# Altium project m12can.PrjPCB
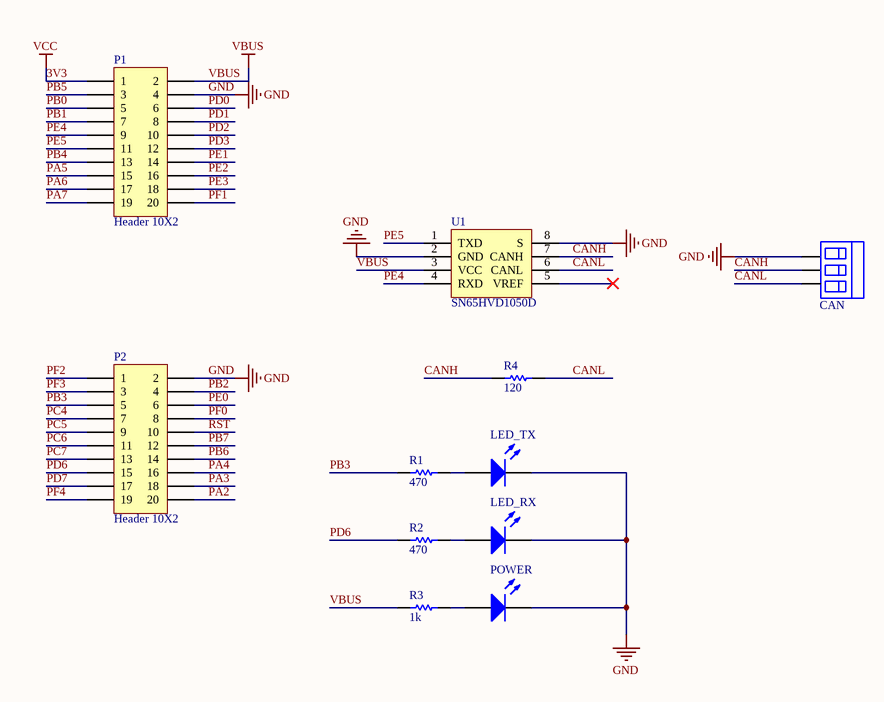
[diagram p0: m12can.SchDoc]
1 sheet, 11 parts. Net scope: global (net labels, ports and power ports of the same name join across sheets).
Board file: m12can.PcbDoc

## Sheet m12can.SchDoc
size A4

### Parts
CAN  CAN  [MKDSN_3RMI]  (value not drawn)
LED_RX  LED2  [LED_0603_RED]  (value not drawn)
LED_TX  LED2  [LED_0603_RED]  (value not drawn)
P1  Header 10X2  [HDR2X10]
P2  Header 10X2  [HDR2X10]
POWER  LED2  [LED_0603_RED]  (value not drawn)
R1  value 470  [RES_0603]  (hidden comment: Res1)
R2  value 470  [RES_0603]  (hidden comment: Res1)
R3  value 1k  [RES_0603]  (hidden comment: Res1)
R4  value 120  [RES_0603]  (hidden comment: Res1)
U1  SN65HVD1050D  [SOIC-8]

### Nets
3V3: P1.1  [also labelled VCC]
GND: CAN.1 LED_RX.2(K) LED_TX.2(K) P1.4 P2.2 POWER.2(K) U1.2(GND) U1.8(S)
VBUS: P1.2 R3.1 U1.3(VCC)
CANH: CAN.2 R4.1 U1.7(CANH)
CANL: CAN.3 R4.2 U1.6(CANL)
PA2: P2.20
PA3: P2.18
PA4: P2.16
PA5: P1.15
PA6: P1.17
PA7: P1.19
PB0: P1.5
PB1: P1.7
PB2: P2.4
PB3: P2.5 R1.1
PB4: P1.13
PB5: P1.3
PB6: P2.14
PB7: P2.12
PC4: P2.7
PC5: P2.9
PC6: P2.11
PC7: P2.13
PD0: P1.6
PD1: P1.8
PD2: P1.10
PD3: P1.12
PD6: P2.15 R2.1
PD7: P2.17
PE0: P2.6
PE1: P1.14
PE2: P1.16
PE3: P1.18
PE4: P1.9 U1.4(RXD)
PE5: P1.11 U1.1(TXD)
PF0: P2.8
PF1: P1.20
PF2: P2.1
PF3: P2.3
PF4: P2.19
RST: P2.10
NetLED_RX_1: LED_RX.1(A) R2.2
NetLED_TX_1: LED_TX.1(A) R1.2
NetPOWER_1: POWER.1(A) R3.2

Not connected (* = marked no-connect by the designer): U1 5(VREF)*

### Library data of the parts
CAN = HEAD3
LED_RX LED_TX POWER = LED2: Typical RED, GREEN, YELLOW, AMBER GaAs LED; Published: 8-Jun-2000; LatestRevisionDate: 17-Jul-2002; LatestRevisionNote: Re-released for DXP Platform.; PackageVersion: Feb-2002; PackageReference: 3.2X1.6X1.1; Publisher: Altium Limited
P1 P2 = Header 10X2: Header, 10-Pin, Dual row; LatestRevisionDate: 17-Jul-2002; LatestRevisionNote: Re-released for DXP Platform.; Publisher: Altium Limited
R1-R4 = Res1: Resistor; Published: 8-Jun-2000; LatestRevisionDate: 17-Jul-2002; LatestRevisionNote: Re-released for DXP Platform.; PackageReference: AXIAL-0.3; Publisher: Altium Limited
U1 = SN65HVD1050D: EMC OPTIMIZED CAN TRANSCEIVER,SN65HVD1050D